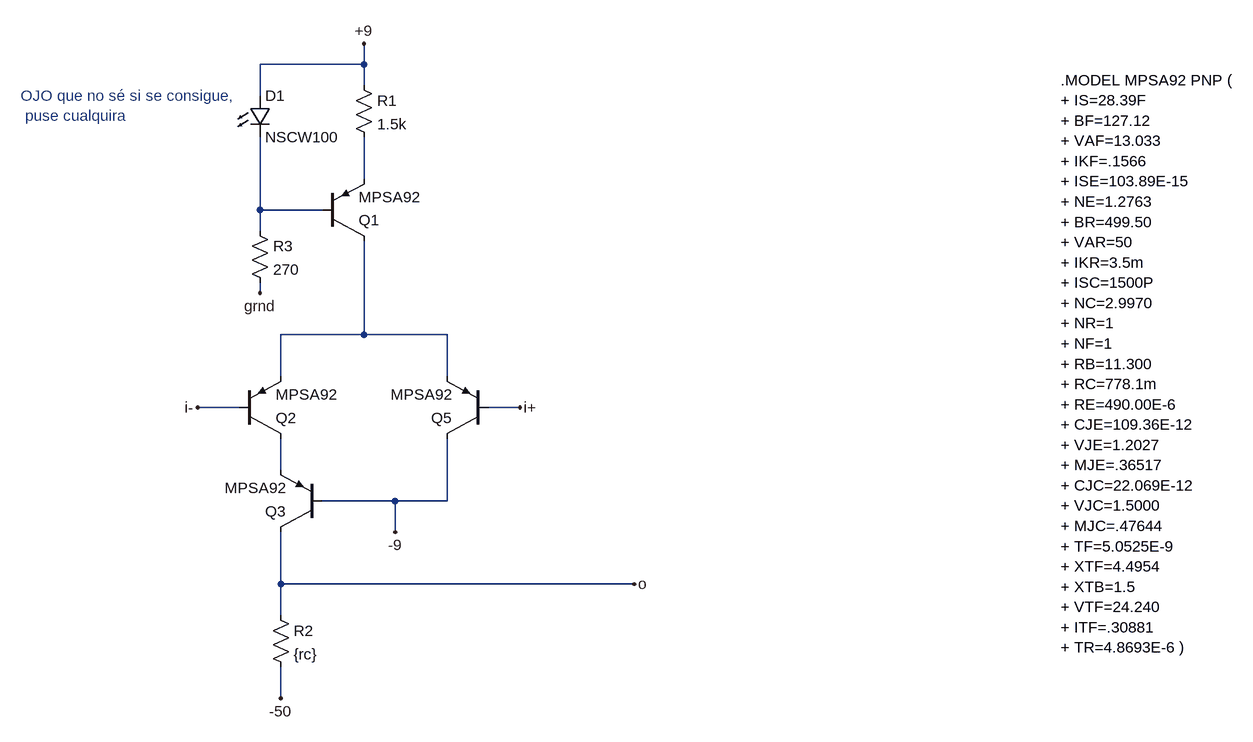
[diagram p0: schematic ss-par-cascode-pnp.asc]
ss-par-cascode-pnp.asc, the LTspice schematic file:
Version 4
SHEET 1 1328 856
WIRE -48 -224 -48 -256
WIRE -48 -224 -208 -224
WIRE -48 -192 -48 -224
WIRE -208 -176 -208 -224
WIRE -48 -48 -48 -112
WIRE -208 0 -208 -112
WIRE -112 0 -208 0
WIRE -208 32 -208 0
WIRE -208 128 -208 112
WIRE -48 192 -48 48
WIRE -48 192 -176 192
WIRE 80 192 -48 192
WIRE -176 256 -176 192
WIRE 80 256 80 192
WIRE -240 304 -304 304
WIRE 192 304 144 304
WIRE -176 400 -176 352
WIRE 0 448 -112 448
WIRE 80 448 80 352
WIRE 80 448 0 448
WIRE 0 496 0 448
WIRE -176 576 -176 496
WIRE 368 576 -176 576
WIRE -176 624 -176 576
WIRE -176 752 -176 704
FLAG -48 -256 +9
FLAG 0 496 -9
FLAG -176 752 -50
FLAG -304 304 i-
FLAG 192 304 i+
FLAG 368 576 o
FLAG -208 128 grnd
SYMBOL res -64 -208 R0
SYMATTR InstName R1
SYMATTR Value 1.5k
SYMBOL rui\\shortcuts\\pnp -112 48 M180
SYMATTR InstName Q1
SYMATTR Value MPSA92
SYMBOL rui\\shortcuts\\pnp -240 352 M180
SYMATTR InstName Q2
SYMATTR Value MPSA92
SYMBOL rui\\shortcuts\\pnp -112 496 R180
SYMATTR InstName Q3
SYMATTR Value MPSA92
SYMBOL res -192 608 R0
SYMATTR InstName R2
SYMATTR Value {rc}
SYMBOL rui\\shortcuts\\pnp 144 352 R180
SYMATTR InstName Q5
SYMATTR Value MPSA92
SYMBOL LED -224 -176 R0
SYMATTR InstName D1
SYMATTR Value NSCW100
SYMBOL res -224 16 R0
SYMATTR InstName R3
SYMATTR Value 270
TEXT 1024 -200 Left 2 !.MODEL MPSA92 PNP (\n+ IS=28.39F\n+ BF=127.12\n+ VAF=13.033\n+ IKF=.1566\n+ ISE=103.89E-15\n+ NE=1.2763\n+ BR=499.50\n+ VAR=50\n+ IKR=3.5m\n+ ISC=1500P\n+ NC=2.9970\n+ NR=1\n+ NF=1\n+ RB=11.300\n+ RC=778.1m\n+ RE=490.00E-6\n+ CJE=109.36E-12\n+ VJE=1.2027\n+ MJE=.36517\n+ CJC=22.069E-12\n+ VJC=1.5000\n+ MJC=.47644\n+ TF=5.0525E-9\n+ XTF=4.4954\n+ XTB=1.5\n+ VTF=24.240\n+ ITF=.30881\n+ TR=4.8693E-6 )
TEXT -576 -176 Left 2 ;OJO que no sé si se consigue,\n puse cualquira

The netlist it stands for:
* ss-par-cascode-pnp.asc
R1 +9 N001 1.5k
Q1 N003 N002 N001 0 MPSA92
Q2 N004 i- N003 0 MPSA92
Q3 o -9 N004 0 MPSA92
R2 o -50 {rc}
Q5 -9 i+ N003 0 MPSA92
D1 +9 N002 NSCW100
R3 N002 grnd 270
.model D D
.lib standard.dio
.model NPN NPN
.model PNP PNP
.lib standard.bjt
.MODEL MPSA92 PNP (
+ IS=28.39F
+ BF=127.12
+ VAF=13.033
+ IKF=.1566
+ ISE=103.89E-15
+ NE=1.2763
+ BR=499.50
+ VAR=50
+ IKR=3.5m
+ ISC=1500P
+ NC=2.9970
+ NR=1
+ NF=1
+ RB=11.300
+ RC=778.1m
+ RE=490.00E-6
+ CJE=109.36E-12
+ VJE=1.2027
+ MJE=.36517
+ CJC=22.069E-12
+ VJC=1.5000
+ MJC=.47644
+ TF=5.0525E-9
+ XTF=4.4954
+ XTB=1.5
+ VTF=24.240
+ ITF=.30881
+ TR=4.8693E-6 )
* OJO que no sé si se consigue,
*  puse cualquira
.backanno
.end